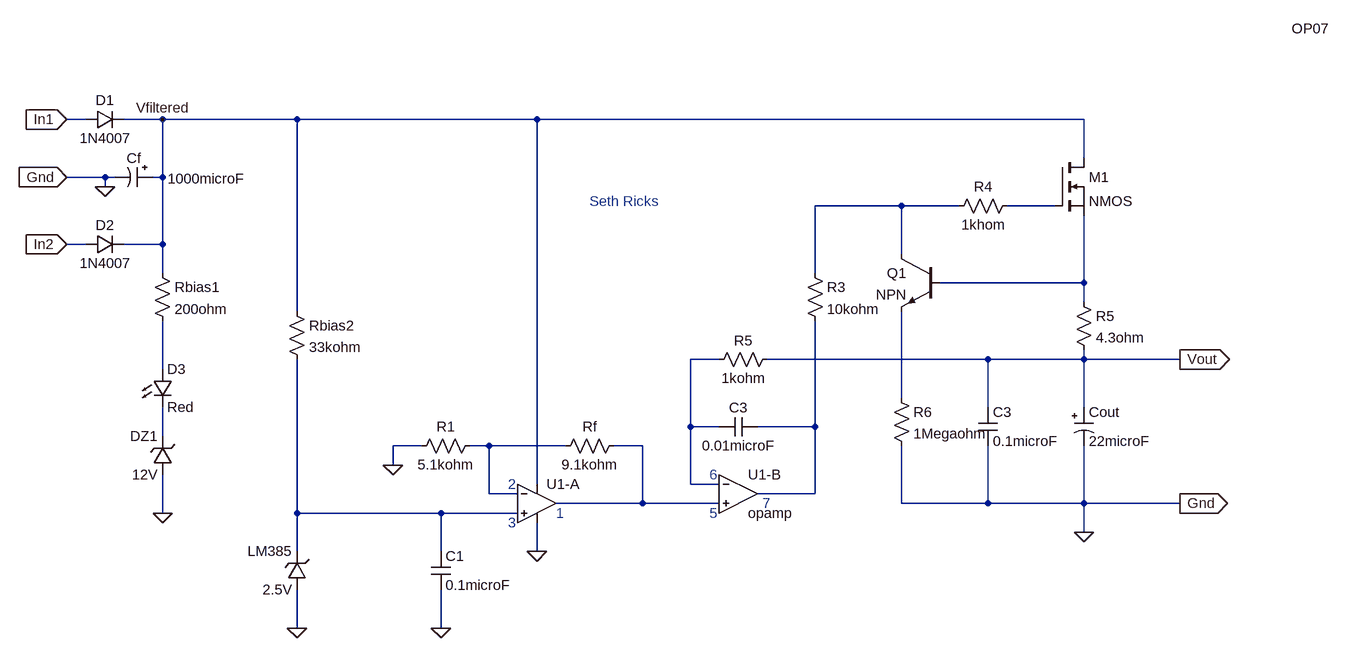
[diagram p0: schematic Final_Lab.asc]
Final_Lab.asc, the LTspice schematic file:
Version 4.1
SHEET 1 3032 772
WIRE -288 -96 -320 -96
WIRE -160 -96 -224 -96
WIRE 64 -96 -160 -96
WIRE 464 -96 64 -96
WIRE 1376 -96 464 -96
WIRE 1376 -32 1376 -96
WIRE -256 0 -320 0
WIRE -240 0 -256 0
WIRE -160 0 -160 -96
WIRE -160 0 -176 0
WIRE -256 16 -256 0
WIRE 1072 48 928 48
WIRE 1168 48 1072 48
WIRE 1328 48 1248 48
WIRE -288 112 -320 112
WIRE -160 112 -160 0
WIRE -160 112 -224 112
WIRE 1072 128 1072 48
WIRE -160 160 -160 112
WIRE 928 160 928 48
WIRE 1376 176 1376 64
WIRE 1376 176 1136 176
WIRE 1376 208 1376 176
WIRE 64 224 64 -96
WIRE 768 304 720 304
WIRE 1216 304 848 304
WIRE 1376 304 1376 288
WIRE 1376 304 1216 304
WIRE 1536 304 1376 304
WIRE -160 320 -160 240
WIRE 1072 368 1072 224
WIRE 1216 384 1216 304
WIRE 1376 384 1376 304
WIRE 720 416 720 304
WIRE 768 416 720 416
WIRE 928 416 928 240
WIRE 928 416 832 416
WIRE -160 432 -160 384
WIRE 272 448 224 448
WIRE 384 448 352 448
WIRE 512 448 384 448
WIRE 640 448 592 448
WIRE 224 480 224 448
WIRE 464 512 464 -96
WIRE 720 512 720 416
WIRE 768 512 720 512
WIRE 384 528 384 448
WIRE 432 528 384 528
WIRE 928 528 928 416
WIRE 928 528 832 528
WIRE 640 544 640 448
WIRE 640 544 496 544
WIRE 768 544 640 544
WIRE 1072 544 1072 448
WIRE 1216 544 1216 448
WIRE 1216 544 1072 544
WIRE 1376 544 1376 448
WIRE 1376 544 1216 544
WIRE 1536 544 1376 544
WIRE -160 560 -160 496
WIRE 64 560 64 304
WIRE 304 560 64 560
WIRE 432 560 304 560
WIRE 1376 592 1376 544
WIRE 64 624 64 560
WIRE 304 624 304 560
WIRE 464 624 464 576
WIRE 64 752 64 688
WIRE 304 752 304 688
FLAG -320 -96 In1
IOPIN -320 -96 In
FLAG -320 0 Gnd
IOPIN -320 0 In
FLAG -320 112 In2
IOPIN -320 112 In
FLAG -256 16 0
FLAG -160 560 0
FLAG 64 752 0
FLAG 304 752 0
FLAG 224 480 0
FLAG 464 624 0
FLAG 1536 304 Vout
IOPIN 1536 304 Out
FLAG 1536 544 Gnd
IOPIN 1536 544 Out
FLAG 1376 592 0
FLAG -160 -96 Vfiltered
SYMBOL diode -288 -80 R270
WINDOW 0 32 32 VTop 2
WINDOW 3 0 32 VBottom 2
SYMATTR InstName D1
SYMATTR Value 1N4007
SYMBOL diode -288 128 R270
WINDOW 0 32 32 VTop 2
WINDOW 3 0 32 VBottom 2
SYMATTR InstName D2
SYMATTR Value 1N4007
SYMBOL res -176 144 R0
SYMATTR InstName Rbias1
SYMATTR Value 200ohm
SYMBOL polcap -176 -16 R90
WINDOW 0 0 32 VBottom 2
WINDOW 3 3 -89 VTop 2
SYMATTR InstName Cf
SYMATTR Value 1000microF
SYMATTR SpiceLine V=50V
SYMBOL LED -176 320 R0
SYMATTR InstName D3
SYMATTR Value Red
SYMBOL zener -144 496 R180
WINDOW 0 24 64 Left 2
WINDOW 3 24 0 Left 2
SYMATTR InstName DZ1
SYMATTR Value 12V
SYMBOL res 48 208 R0
SYMATTR InstName Rbias2
SYMATTR Value 33kohm
SYMBOL zener 80 688 R180
WINDOW 0 24 64 Left 2
WINDOW 3 24 0 Left 2
SYMATTR InstName LM385
SYMATTR Value 2.5V
SYMBOL cap 288 624 R0
SYMATTR InstName C1
SYMATTR Value 0.1microF
SYMBOL OpAmps\\OP07 464 480 R0
WINDOW 3 2504 -3650 Left 2
SYMATTR InstName U1-A
SYMBOL res 368 432 R90
WINDOW 0 0 56 VBottom 2
WINDOW 3 32 56 VTop 2
SYMATTR InstName R1
SYMATTR Value 5.1kohm
SYMBOL res 608 432 R90
WINDOW 0 0 56 VBottom 2
WINDOW 3 32 56 VTop 2
SYMATTR InstName Rf
SYMATTR Value 9.1kohm
SYMBOL cap 832 400 R90
WINDOW 0 0 32 VBottom 2
WINDOW 3 32 32 VTop 2
SYMATTR InstName C3
SYMATTR Value 0.01microF
SYMBOL res 864 288 R90
WINDOW 0 0 56 VBottom 2
WINDOW 3 32 56 VTop 2
SYMATTR InstName R5
SYMATTR Value 1kohm
SYMBOL res 912 144 R0
SYMATTR InstName R3
SYMATTR Value 10kohm
SYMBOL npn 1136 128 M0
SYMATTR InstName Q1
SYMBOL res 1056 352 R0
SYMATTR InstName R6
SYMATTR Value 1Megaohm
SYMBOL cap 1200 384 R0
SYMATTR InstName C3
SYMATTR Value 0.1microF
SYMBOL polcap 1360 384 R0
SYMATTR InstName Cout
SYMATTR Value 22microF
SYMBOL res 1264 32 R90
WINDOW 0 0 56 VBottom 2
WINDOW 3 32 56 VTop 2
SYMATTR InstName R4
SYMATTR Value 1khom
SYMBOL nmos 1328 -32 R0
SYMATTR InstName M1
SYMBOL res 1360 192 R0
SYMATTR InstName R5
SYMATTR Value 4.3ohm
SYMBOL OpAmps\\opamp 800 464 R0
SYMATTR InstName U1-B
TEXT 552 40 Left 2 ;Seth Ricks
TEXT 496 560 Left 2 ;1
TEXT 416 512 Left 2 ;2
TEXT 416 576 Left 2 ;3
TEXT 752 496 Left 2 ;6
TEXT 752 560 Left 2 ;5
TEXT 840 544 Left 2 ;7

The netlist it stands for:
* Final_Lab.asc
D1 In1 Vfiltered 1N4007
D2 In2 Vfiltered 1N4007
Rbias1 Vfiltered N005 200ohm
Cf Vfiltered 0 1000microF V=50V
D3 N005 N008 Red
DZ1 0 N008 12V
Rbias2 Vfiltered N011 33kohm
D§LM385 0 N011 2.5V
C1 N011 0 0.1microF
X§U1-A N011 N009 Vfiltered 0 N010 LT1001  ; OP07, pins In+ In- V+ V- OUT
R1 N009 0 5.1kohm
Rf N010 N009 9.1kohm
C3 N007 N004 0.01microF
R5 Vout N004 1kohm
R3 N001 N007 10kohm
Q1 N001 N003 N006 0 NPN
R6 N006 0 1Megaohm
C3 Vout 0 0.1microF
Cout Vout 0 22microF
R4 N002 N001 1khom
M1 Vfiltered N002 N003 N003 NMOS
R5 N003 Vout 4.3ohm
X§U1-B N004 N010 N007 opamp Aol=100K GBW=10Meg  ; pins invin noninvin out
.model D D
.lib standard.dio
.model NPN NPN
.model PNP PNP
.lib standard.bjt
.model NMOS NMOS
.model PMOS PMOS
.lib standard.mos
* Seth Ricks
* 1
* 2
* 3
* 6
* 5
* 7
.lib LTC.lib
.backanno
.end